# EAGLE schematic Callisto_Limit_Switch_PX_v1p1 (EAGLE 9.6.2)
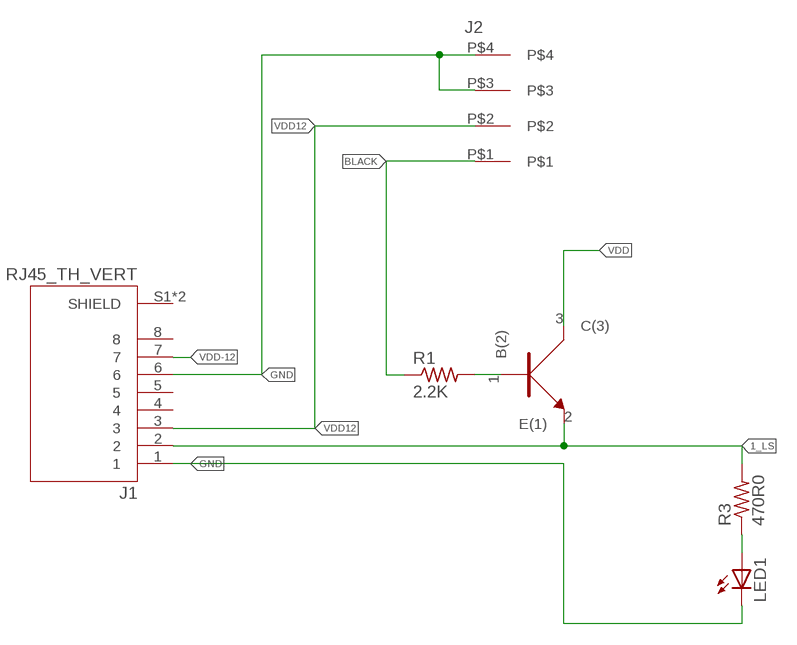
[diagram p0: schematic, sheet 1]

## Parts
J1  RJ45_TH_VERT  [ASSMANN_A-2014-2S-4-N-R]
J2  4-pos  3.81MM_1_X_4_RT_ANGLE_PLUG_HEADER  [1X4_3.81MM_PITCH]
LED1  Green  LED_0805_GREEN  [0805]
R1  2.2K  R_0402  [0402]
R3  470R0  R_0402_470R0  [0402]
U1  NPN  BC846BW  [SOT323]

## Nets
1_LS: J1.2 R3.P$2 U1.2(E(1))
BLACK: J2.P$1 R1.P$1
GND: J1.1 J1.6 J2.P$3 J2.P$4 LED1.2(C)
N$1: R1.P$2 U1.1(B(2))
N$2: LED1.1(A) R3.P$1
VDD: U1.3(C(3))
VDD12: J1.3 J2.P$2
VDD-12: J1.7
Unconnected: J1.4 J1.5 J1.8 J1.S1(SHIELD) J1.S2(SHIELD)

## Library data of the parts
J1 = 3D_MIG_Controller:RJ45_TH_VERT: Jack Modular Connector 8p8c (RJ45, Ethernet) Vertical Shielded; DESCRIPTION: Jack Modular Connector 8p8c (RJ45, Ethernet) Vertical Shielded; DIGI-KEY_PART_NUMBER: AE10399-ND; MF: Assmann WSW Components; MP: A-2014-2S-4-N-R; PACKAGE: None
J2 = 3D_MIG_Controller:3.81MM_1_X_4_RT_ANGLE_PLUG_HEADER: 4 Position Terminal Block Header, Male Pins, Shrouded (4 Side) 0.150" (3.81mm) 90°, Right Angle - Through Hole; PARTNO: 691322310004
LED1 = 3D_MIG_Controller:LED_0805_GREEN: Green 570nm LED Indication - Discrete 2.2V 0805 (2012 Metric); PARTNO: LG R971-KN-1
R1 = 3D_MIG_Controller:R_0402
R3 = 3D_MIG_Controller:R_0402_470R0; PARTNO: RMCF0402JT470R
U1 = 3D_MIG_Controller:BC846BW: Bipolar (BJT) Transistor NPN 100MHz Surface Mount SOT-323; PARTNO: BC846BW_NPN